# Altium project CYBERGATE_V1_BASEBOARD.PrjPcb
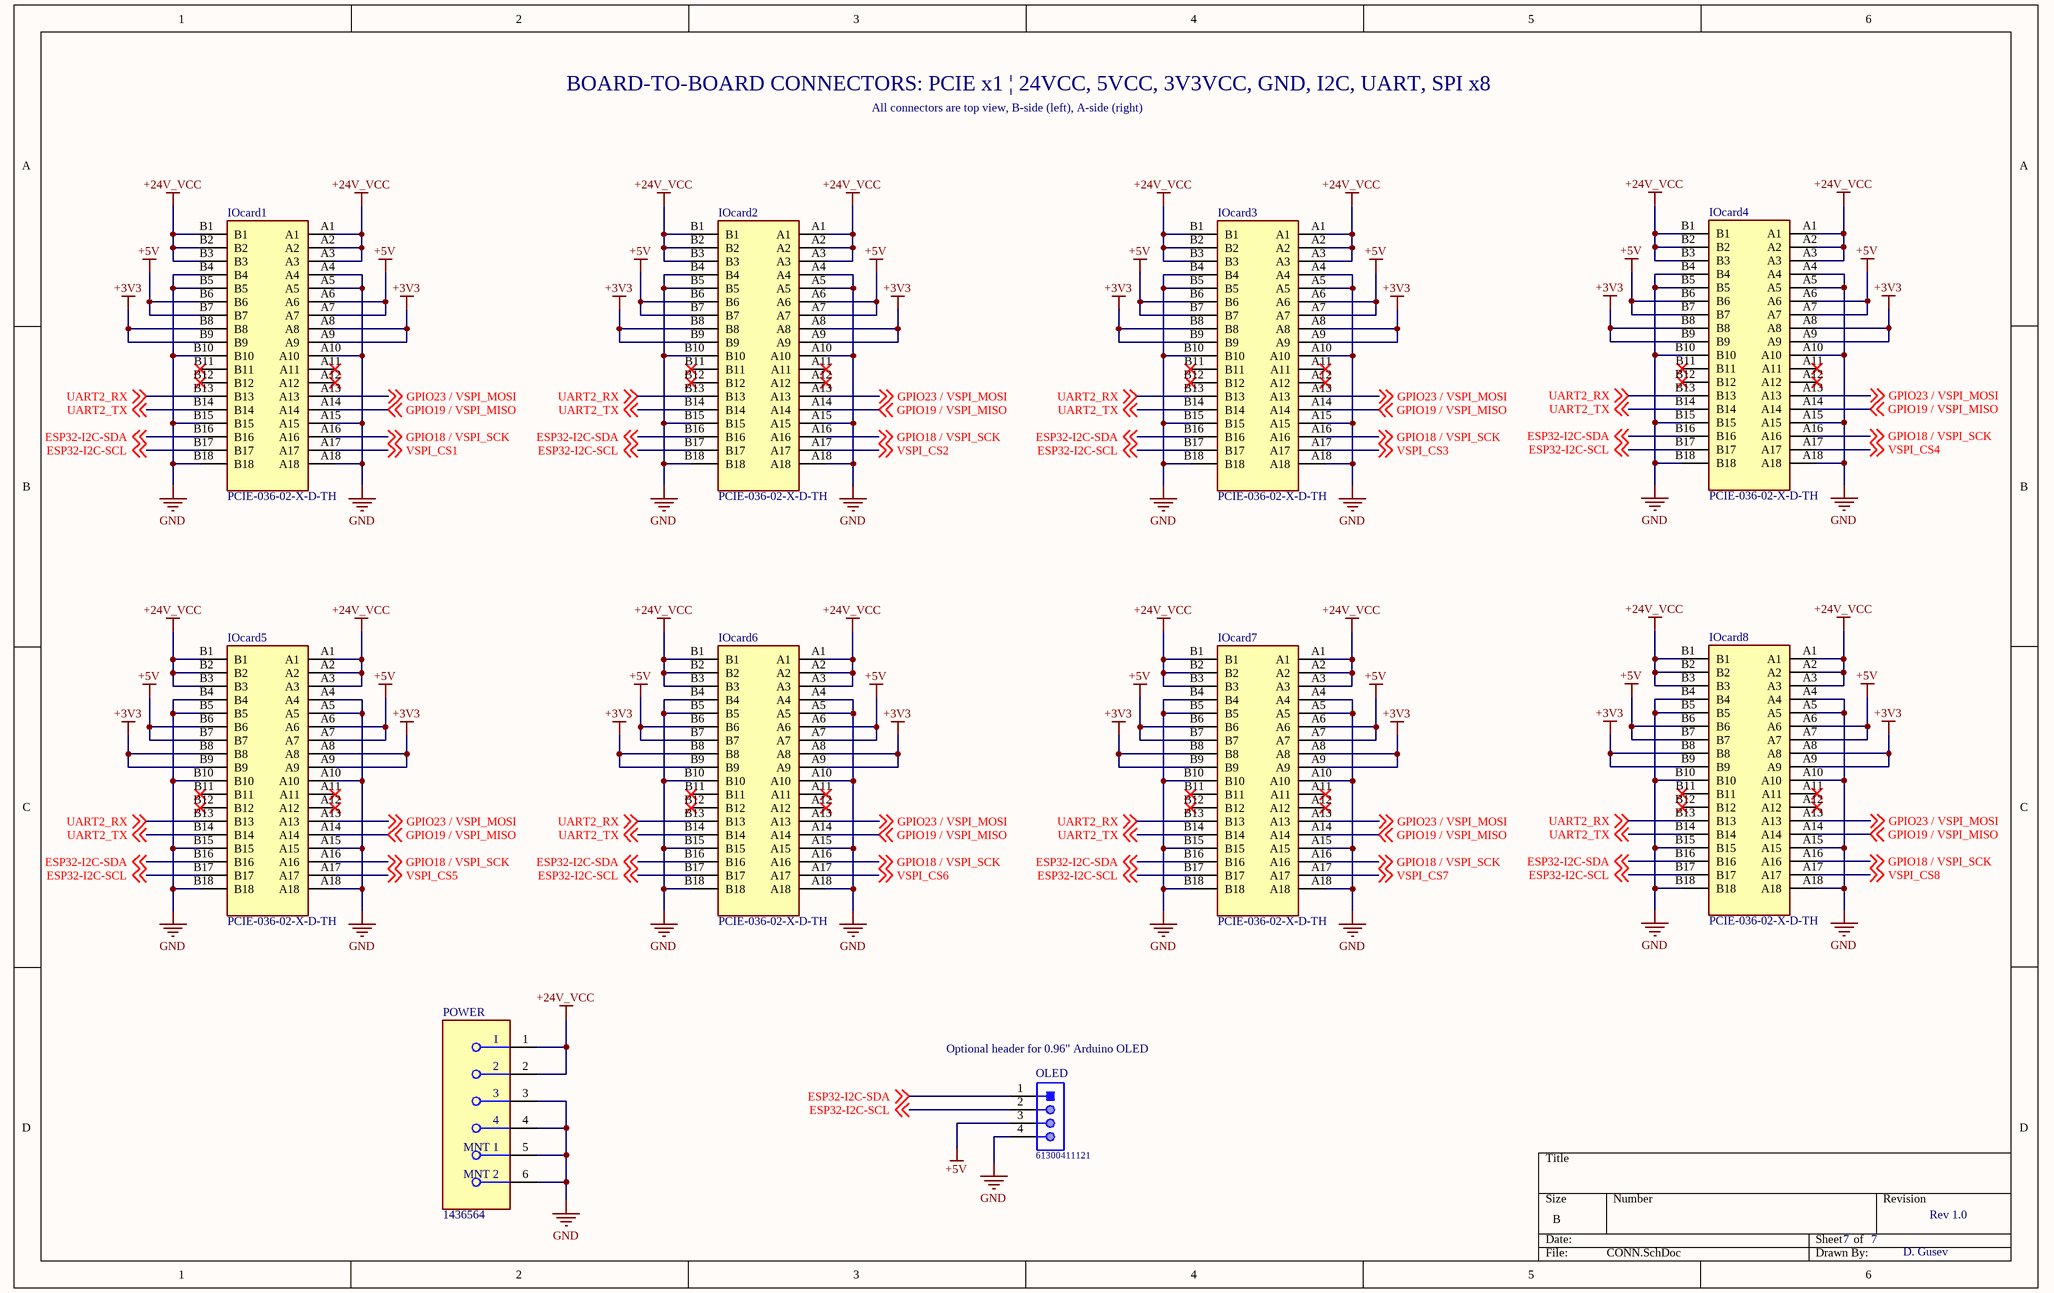
[diagram p0: CONN.SchDoc]
1 sheet, 10 parts. Net scope: global (net labels, ports and power ports of the same name join across sheets).

## Sheet CONN.SchDoc
size B

### Parts
IOcard1  PCIE-036-02-X-D-TH  [SAMTEC_PCIE-036-02-X-D-TH]
IOcard2  PCIE-036-02-X-D-TH  [SAMTEC_PCIE-036-02-X-D-TH]
IOcard3  PCIE-036-02-X-D-TH  [SAMTEC_PCIE-036-02-X-D-TH]
IOcard4  PCIE-036-02-X-D-TH  [SAMTEC_PCIE-036-02-X-D-TH]
IOcard5  PCIE-036-02-X-D-TH  [SAMTEC_PCIE-036-02-X-D-TH]
IOcard6  PCIE-036-02-X-D-TH  [SAMTEC_PCIE-036-02-X-D-TH]
IOcard7  PCIE-036-02-X-D-TH  [SAMTEC_PCIE-036-02-X-D-TH]
IOcard8  PCIE-036-02-X-D-TH  [SAMTEC_PCIE-036-02-X-D-TH]
OLED  61300411121  [61300411121]
POWER  1436564  [FP-1436564-MFG]

### Nets
+3V3: IOcard1.A8 IOcard1.A9 IOcard1.B8 IOcard1.B9 IOcard2.A8 IOcard2.A9 IOcard2.B8 IOcard2.B9 IOcard3.A8 IOcard3.A9 IOcard3.B8 IOcard3.B9 IOcard4.A8 IOcard4.A9 IOcard4.B8 IOcard4.B9 IOcard5.A8 IOcard5.A9 IOcard5.B8 IOcard5.B9 IOcard6.A8 IOcard6.A9 IOcard6.B8 IOcard6.B9 IOcard7.A8 IOcard7.A9 IOcard7.B8 IOcard7.B9 IOcard8.A8 IOcard8.A9 IOcard8.B8 IOcard8.B9
+5V: IOcard1.A6 IOcard1.A7 IOcard1.B6 IOcard1.B7 IOcard2.A6 IOcard2.A7 IOcard2.B6 IOcard2.B7 IOcard3.A6 IOcard3.A7 IOcard3.B6 IOcard3.B7 IOcard4.A6 IOcard4.A7 IOcard4.B6 IOcard4.B7 IOcard5.A6 IOcard5.A7 IOcard5.B6 IOcard5.B7 IOcard6.A6 IOcard6.A7 IOcard6.B6 IOcard6.B7 IOcard7.A6 IOcard7.A7 IOcard7.B6 IOcard7.B7 IOcard8.A6 IOcard8.A7 IOcard8.B6 IOcard8.B7 OLED.3
+24V_VCC: IOcard1.A1 IOcard1.A2 IOcard1.A3 IOcard1.B1 IOcard1.B2 IOcard1.B3 IOcard2.A1 IOcard2.A2 IOcard2.A3 IOcard2.B1 IOcard2.B2 IOcard2.B3 IOcard3.A1 IOcard3.A2 IOcard3.A3 IOcard3.B1 IOcard3.B2 IOcard3.B3 IOcard4.A1 IOcard4.A2 IOcard4.A3 IOcard4.B1 IOcard4.B2 IOcard4.B3 IOcard5.A1 IOcard5.A2 IOcard5.A3 IOcard5.B1 IOcard5.B2 IOcard5.B3 IOcard6.A1 IOcard6.A2 IOcard6.A3 IOcard6.B1 IOcard6.B2 IOcard6.B3 IOcard7.A1 IOcard7.A2 IOcard7.A3 IOcard7.B1 IOcard7.B2 IOcard7.B3 IOcard8.A1 IOcard8.A2 IOcard8.A3 IOcard8.B1 IOcard8.B2 IOcard8.B3 POWER.1 POWER.2
GND: IOcard1.A4 IOcard1.A5 IOcard1.A10 IOcard1.A15 IOcard1.A18 IOcard1.B4 IOcard1.B5 IOcard1.B10 IOcard1.B15 IOcard1.B18 IOcard2.A4 IOcard2.A5 IOcard2.A10 IOcard2.A15 IOcard2.A18 IOcard2.B4 IOcard2.B5 IOcard2.B10 IOcard2.B15 IOcard2.B18 IOcard3.A4 IOcard3.A5 IOcard3.A10 IOcard3.A15 IOcard3.A18 IOcard3.B4 IOcard3.B5 IOcard3.B10 IOcard3.B15 IOcard3.B18 IOcard4.A4 IOcard4.A5 IOcard4.A10 IOcard4.A15 IOcard4.A18 IOcard4.B4 IOcard4.B5 IOcard4.B10 IOcard4.B15 IOcard4.B18 IOcard5.A4 IOcard5.A5 IOcard5.A10 IOcard5.A15 IOcard5.A18 IOcard5.B4 IOcard5.B5 IOcard5.B10 IOcard5.B15 IOcard5.B18 IOcard6.A4 IOcard6.A5 IOcard6.A10 IOcard6.A15 IOcard6.A18 IOcard6.B4 IOcard6.B5 IOcard6.B10 IOcard6.B15 IOcard6.B18 IOcard7.A4 IOcard7.A5 IOcard7.A10 IOcard7.A15 IOcard7.A18 IOcard7.B4 IOcard7.B5 IOcard7.B10 IOcard7.B15 IOcard7.B18 IOcard8.A4 IOcard8.A5 IOcard8.A10 IOcard8.A15 IOcard8.A18 IOcard8.B4 IOcard8.B5 IOcard8.B10 IOcard8.B15 IOcard8.B18 OLED.4 POWER.3 POWER.4 POWER.5(MNT_1) POWER.6(MNT_2)
ESP32-I2C-SCL: IOcard1.B17 IOcard2.B17 IOcard3.B17 IOcard4.B17 IOcard5.B17 IOcard6.B17 IOcard7.B17 IOcard8.B17 OLED.2 ; off-sheet ESP32-I2C-SCL
ESP32-I2C-SDA: IOcard1.B16 IOcard2.B16 IOcard3.B16 IOcard4.B16 IOcard5.B16 IOcard6.B16 IOcard7.B16 IOcard8.B16 OLED.1 ; off-sheet ESP32-I2C-SDA
GPIO18 / VSPI_SCK: IOcard1.A16 IOcard2.A16 IOcard3.A16 IOcard4.A16 IOcard5.A16 IOcard6.A16 IOcard7.A16 IOcard8.A16 ; off-sheet GPIO18 / VSPI_SCK
GPIO19 / VSPI_MISO: IOcard1.A14 IOcard2.A14 IOcard3.A14 IOcard4.A14 IOcard5.A14 IOcard6.A14 IOcard7.A14 IOcard8.A14 ; off-sheet GPIO19 / VSPI_MISO
GPIO23 / VSPI_MOSI: IOcard1.A13 IOcard2.A13 IOcard3.A13 IOcard4.A13 IOcard5.A13 IOcard6.A13 IOcard7.A13 IOcard8.A13 ; off-sheet GPIO23 / VSPI_MOSI
UART2_RX: IOcard1.B13 IOcard2.B13 IOcard3.B13 IOcard4.B13 IOcard5.B13 IOcard6.B13 IOcard7.B13 IOcard8.B13 ; off-sheet UART2_RX
UART2_TX: IOcard1.B14 IOcard2.B14 IOcard3.B14 IOcard4.B14 IOcard5.B14 IOcard6.B14 IOcard7.B14 IOcard8.B14 ; off-sheet UART2_TX
VSPI_CS1: IOcard1.A17 ; off-sheet VSPI_CS1
VSPI_CS2: IOcard2.A17 ; off-sheet VSPI_CS2
VSPI_CS3: IOcard3.A17 ; off-sheet VSPI_CS3
VSPI_CS4: IOcard4.A17 ; off-sheet VSPI_CS4
VSPI_CS5: IOcard5.A17 ; off-sheet VSPI_CS5
VSPI_CS6: IOcard6.A17 ; off-sheet VSPI_CS6
VSPI_CS7: IOcard7.A17 ; off-sheet VSPI_CS7
VSPI_CS8: IOcard8.A17 ; off-sheet VSPI_CS8

Not connected (* = marked no-connect by the designer): IOcard1 A11* A12* B11* B12*; IOcard2 A11* A12* B11* B12*; IOcard3 A11* A12* B11* B12*; IOcard4 A11* A12* B11* B12*; IOcard5 A11* A12* B11* B12*; IOcard6 A11* A12* B11* B12*; IOcard7 A11* A12* B11* B12*; IOcard8 A11* A12* B11* B12*

### Notes on the sheet
- BOARD-TO-BOARD CONNECTORS: PCIE x1 | 24VCC, 5VCC, 3V3VCC, GND, I2C, UART, SPI x8
- All connectors are top view, B-side (left), A-side (right)
- (near OLED) Optional header for 0.96" Arduino OLED
- 7
- Rev 1.0
- D. Gusev

### Library data of the parts
IOcard1-IOcard8 = PCIE-036-02-X-D-TH: 1.00 mm PCI ExpressÂ® Edge Card Connector; MF: Samtec; Value: *; Availability: Unavailable; Package: None; MP: PCIE-036-02-X-D-TH; Price: None
OLED = CMP-1502-01064-1: THT Vertical Pin Header WR-PHD, Pitch 2.54 mm, Single Row, 4 pins; Manufacturer: Wurth Elektronik; Withstanding Voltage: 500VAC; Rated Current: 3A; Working Voltage: 250VAC; Pin Number: 4; Gender: Male; Contact Resistance: 20mOhm; Pitch: 2.54mm; Manufacturer URL: http://www.we-online.de; Operating Temperature: -40to105degC; Packaging: Bag; Mounting Technology: THT; Package Reference: 61300411121; Datasheet URL: https://katalog.we-online.de/em/datasheet/6130xx11121.pdf; Publisher: WurthElektronik; Part Number: 61300411121; Row Number: Single; Orientation: Vertical
POWER = CMP-09396-000001-1: CONN RCPT FMALE 4POS GOLD SOLDER; Manufacturer: Phoenix Contact; Conn Orientation: Right Angle; Is Female: yes; Current Rating: 4A; Voltage Rating: 250V; Shielding: true; Number Of Contacts: 4; Pitch: 3.54mm; Conn Gender: Female; Device Class L2: Circular Connectors; Temperature Range Low: -25°C; Device Class L3: unset; Device Class L1: Connectors; Ambient Temperature Range Low: -25°C; Octopart: https://octopart.com/1436564-phoenix+contact-12805506; Category: Conn; Package: 1436564; Lead Free: Yes; RoHS: TRUE; Height: 16.4mm; Mouser Description: Circular Metric Connectors FEMALE 4P A-CODED; Automotive: No; Manufacturer Part Number: 1436564; Contact Material: Gold; ComponentLink2URL: https://www.phoenixcontact.com/online/portal/pi/?uri=pxc-oc-itemdetail:pid=1436564&library=pies&pcck=P-18-03-01&tab=1&selectedCategory=ALL; Temperature Range High: +85°C; Ambient Temperature Range High: +85°C; Digikey Description: CONN RCPT FMALE 4POS GOLD SOLDER; Temperature: -25°C to +85°C; ComponentLink2Description: Datasheet